# Altium schematic sheet MB-07-Power.SchDoc
size A4
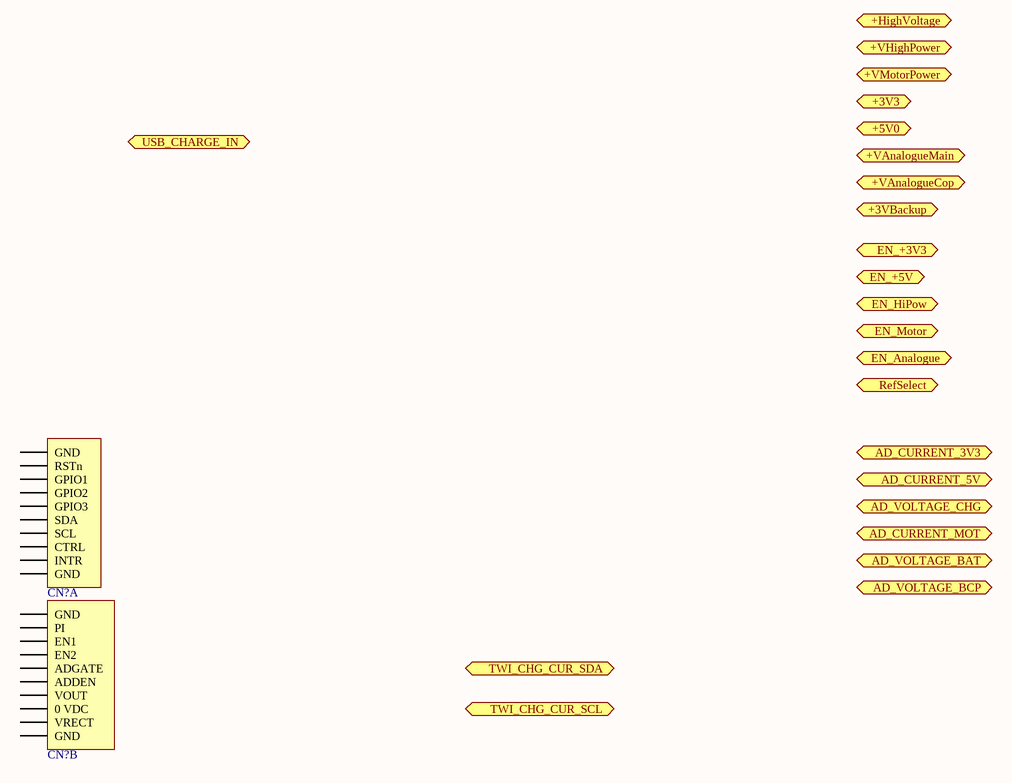
[diagram p0: MB-07-Power.SchDoc]

## Parts
(Parts that share a designator on the sheet are numbered #1, #2 ... from top to bottom, then left to right.)
CN?#1  WirelessPower  [CON_WE_WirelessPower]  (value not drawn)  (part A of 2)
CN?#2  WirelessPower  [CON_WE_WirelessPower]  (value not drawn)  (part B of 2)

## Ports
+3V3 (out), +3VBackup (out), +5V0 (out), +HighVoltage (out), +VAnalogueCop (out), +VAnalogueMain (out), +VHighPower (out), +VMotorPower (out), AD_CURRENT_3V3 (out), AD_CURRENT_5V (out), AD_CURRENT_MOT (out), AD_VOLTAGE_BAT (out), AD_VOLTAGE_BCP (out), AD_VOLTAGE_CHG (out), EN_+3V3 (in), EN_+5V (in), EN_Analogue (in), EN_HiPow (in), EN_Motor (in), RefSelect (in), TWI_CHG_CUR_SCL (bidir), TWI_CHG_CUR_SDA (bidir), USB_CHARGE_IN (in)

## Nets

Not connected (* = marked no-connect by the designer): CN?#1 11(GND) 12(RSTn) 13(GPIO1) 14(GPIO2) 15(GPIO3) 16(SDA) 17(SCL) 18(CTRL) 19(INTR) 20(GND); CN?#2 1(GND) 2(PI) 3(EN1) 4(EN2) 5(ADGATE) 6(ADDEN) 7(VOUT) 8(0_VDC) 9(VRECT) 10(GND)

## Library data of the parts
CN?#1 CN?#2 = CON_WE_WirelessPower: Wurth Elektronik Wireless Power Experimenter Receiver Footprint; Constituant Part 1: *; Constituant Part 1 Count: *; Constituant Part 2: *; Constituant Part 2 Count: *; Constituant Part 3: *; Constituant Part 3 Count: *